# EAGLE design Pendant (EAGLE 7.6.0)

## Sheet 1 of 2
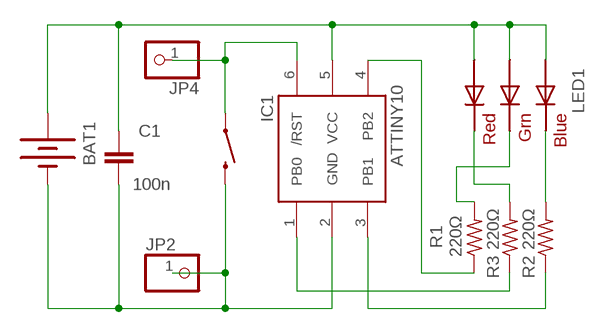
[diagram p0: schematic, sheet 1]

### Parts
BAT1  BATTERY12MM  [BATTCON_12MM]
C1  100n  CAP0603-CAP  [0603-CAP]
IC1  ATTINY10  [SOT23-6]
JP2  PINHD-1X1CB  [1X01-CLEANBIG]
JP4  PINHD-1X1CB  [1X01-CLEANBIG]
LED1  RGBLED5050  [RGBLED5050]
R1  220Ω  R-US_R0805  [R0805]
R2  220Ω  R-US_R0805  [R0805]
R3  220Ω  R-US_R0805  [R0805]
S2  SWITCH-MOMENTARY-2SMD  [TACTILE-SWITCH-SMD]

### Nets
N$1: BAT1.PWR@1(+) C1.1 IC1.5(VCC) LED1.1(GREEN_A) LED1.2(RED_A) LED1.3(BLUE_A)
N$2: IC1.6(/RST) JP4.1 S2.1
N$3: LED1.5(RED_C) R3.2
N$4: LED1.6(GREEN_C) R1.2
N$5: LED1.4(BLUE_C) R2.2
N$6: IC1.1(PB0) R3.1
N$7: BAT1.GND(-) C1.2 IC1.2(GND) JP2.1 S2.3
N$8: IC1.3(PB1) R2.1
N$10: IC1.4(PB2) R1.1

## Sheet 2 of 2

## Library data of the parts
BAT1 = SparkFun-Electromechanical:BATTERY: Battery Holders Various common sizes : AA, AAA, 18650 (PRT-12895), 20mm coin cell and 12mm coin cell. 20MM_4LEGS, BATT-10373; PROD_ID: BATT-08044
C1 = SparkFun-Capacitors:CAP: Capacitor Standard 0603 ceramic capacitor, and 0.1" leaded capacitor.
IC1 = adafruit:ATTINY10: ATtiny4/5/9/10 8-bit Microcontroller with 512/1024 Bytes In-System Programmable Flash
JP2 JP4 = adafruit:PINHD-1X1: Pin header 1x1 for 0.1" spacing With round pins
LED1 = adafruit:RGBLED: For 5050 RGB LEDs, the order of the LEDs may vary from one manufacturer to another!
R1-R3 = adafruit:R-US_: RESISTOR, American symbol
S2 = SparkFun-Electromechanical:SWITCH-MOMENTARY-2: Various NO switches- pushbuttons, reed, etc; PROD_ID: SWCH-08247

## Board
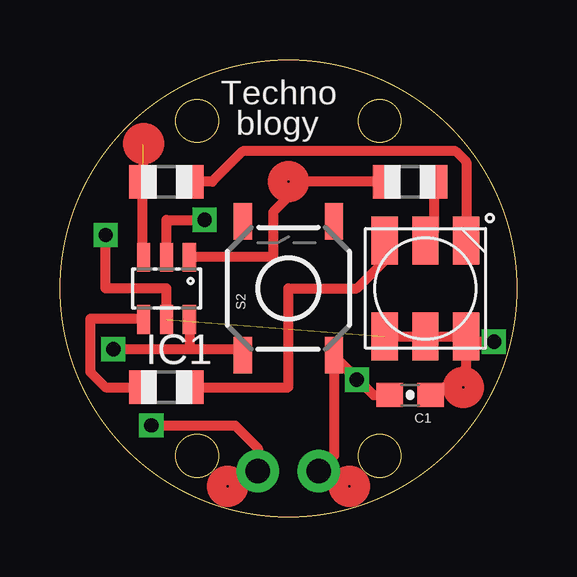
[diagram p1: board, top side]
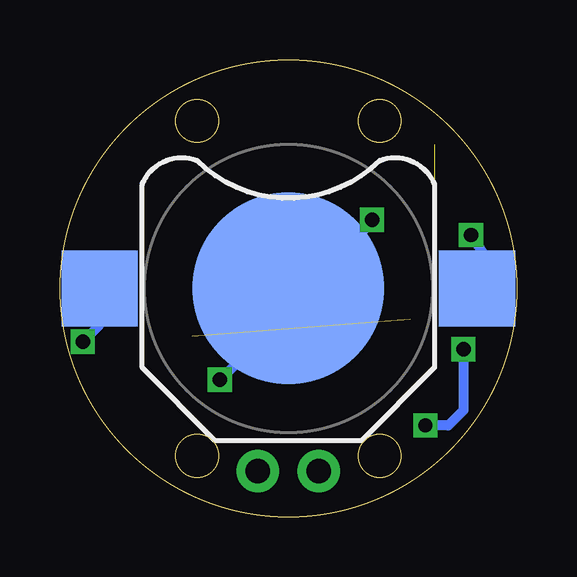
[diagram p2: board, bottom side, seen from below]

Size 19.05 x 19.05 mm. Coordinates in mm from the lower left corner, seen from the top.
Outline: circle at 9.53,9.53 radius 9.53
Outline: circle at 5.71,16.51 radius 0.9
Outline: circle at 13.34,16.51 radius 0.9
Outline: circle at 13.34,2.54 radius 0.9
Outline: circle at 5.71,2.54 radius 0.9
Copper layers (1*16): Top 0.035mm / dielectric 1.5mm / Bottom 0.035mm
Design rules "default": minimum track width 10mil, minimum drill 24mil, track to track 8mil, track to pad 8mil, pad to pad 8mil, via to via 8mil, smd to smd 8mil, copper to edge 40mil, drill to drill 8mil, minimum pad ring 10mil, minimum via ring 8mil, stop-mask expansion 4mil, vias tented up to drill 0mil, thermal gap 10mil

### Footprints (pad centres in the part's own frame; a part is rotated, then mirrored left to right if it is on the bottom)
BATTCON_12MM = smd 8 x 8: GND 0,0 | smd 3.175 x 3.175: PWR@1 -7.874,0; PWR@2 7.874,0
0603-CAP = smd 1.1 x 1: 1 -0.85,0; 2 0.85,0
SOT23-6 = smd 0.55 x 1.2: 1 -0.95,-1.3; 2 0,-1.3; 3 0.95,-1.3; 4 0.95,1.3; 5 0,1.3; 6 -0.95,1.3
1X01-CLEANBIG = drill 1.016 pad 1.778: 1 0,0
RGBLED5050 = smd 2 x 1.1: 1 -2,1.7; 2 -2,0; 3 -2,-1.7; 4 2,-1.7; 5 2,0; 6 2,1.7
R0805 = smd 1.1 x 1.4: 1 -1,0; 2 1,0
TACTILE-SWITCH-SMD = smd 1.524 x 0.762: 1 -2.794,1.905; 2 2.794,1.905; 3 -2.794,-1.905; 4 2.794,-1.905

### Placement (x,y rotation side)
BAT1  9.53,9.53 0 bottom
C1  14.61,5.08 180 top
IC1  4.45,9.53 180 top
JP2  10.79,1.91 0 top
JP4  8.26,1.91 0 top
LED1  15.24,9.53 90 top
R1  4.45,5.4 0 top
R2  4.45,13.97 0 top
R3  14.61,13.97 0 top
S2  9.53,9.53 90 top

### Tracks (layer width: path | path; a pad name or v marks a point on that pad's centre or on a via)
N$1  (via drill 0.6)  (1 unrouted)
  Top 0.406: LED1.1 LED1.2 LED1.3 | IC1.5 4.45,9.53 1.91,9.53 v1.91,11.75 | C1.1 16.94,5.93 LED1.3 | LED1.3 17.16,7.3 v18.1,7.3
  Bottom 0.406: v1.91,11.75 1.27,10.79 1.27,8.89 | v18.1,7.3 17.4,8 BAT1.PWR@1
N$2  (via drill 0.6)
  Top 0.406: IC1.6 5.4,6.99 | 5.4,6.99 v2.22,6.99 | S2.1 7.37,6.99 5.4,6.99 | v3.81,3.81 7.3,3.81 8.26,2.86 JP4.1
  Bottom 0.406: v2.22,6.99 2.22,4.45 2.86,3.81 v3.81,3.81
N$3
  Top 0.406: LED1.5 15.61,11.89 R3.2
N$4
  Top 0.406: R1.2 9.53,5.4 9.53,9.53 12.38,9.53 13.65,10.79 13.65,11.41 LED1.6
N$5
  Top 0.406: LED1.4 16.94,14.81 16.51,15.24 7.62,15.24 6.35,13.97 R2.2
N$6
  Top 0.406: R3.1 10.16,13.97 8.89,12.7 8.89,10.79 8.86,10.82 IC1.1
N$7  (via drill 0.6)
  Top 0.406: S2.3 11.43,2.54 JP2.1 | IC1.2 4.45,12.38 v6.03,12.38 | S2.3 11.43,6.67 v12.38,5.71 | S2.3 13.08,5.08 C1.2
  Bottom 0.406: v6.03,12.38 7.94,10.16 8.89,10.16 BAT1.GND 9.53,8.57 v12.38,5.71
N$8  (1 unrouted)
  Top 0.406: IC1.3 3.44,10.88 R2.1
N$9
  Top 0.406: 3.49,13.97 3.49,15.56
N$10
  Top 0.406: IC1.4 3.44,8.18 3.37,8.26 1.27,8.26 1.27,6.03 1.91,5.4 R1.1 3.44,5.45
(copper drawn outside any net)
  shapes: Top circle x5

### Text on the board
tPlace: Techno | blogy